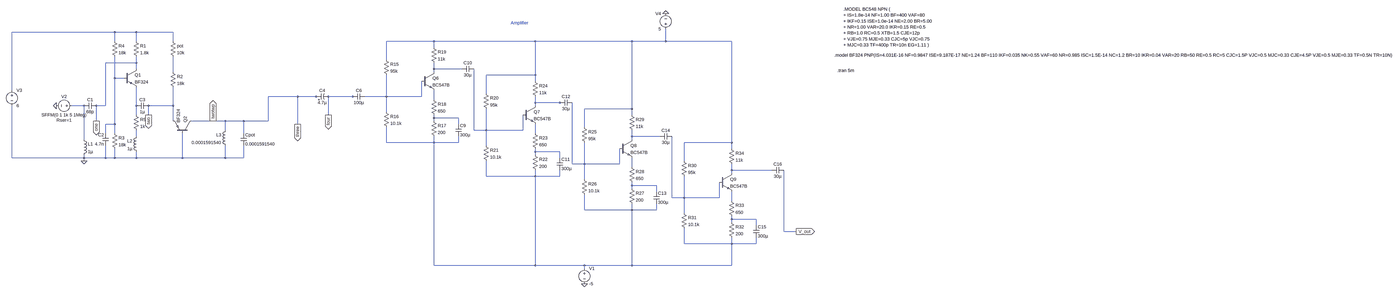
[diagram p0: schematic FM Radio using NPN Transistors.asc, whole sheet]
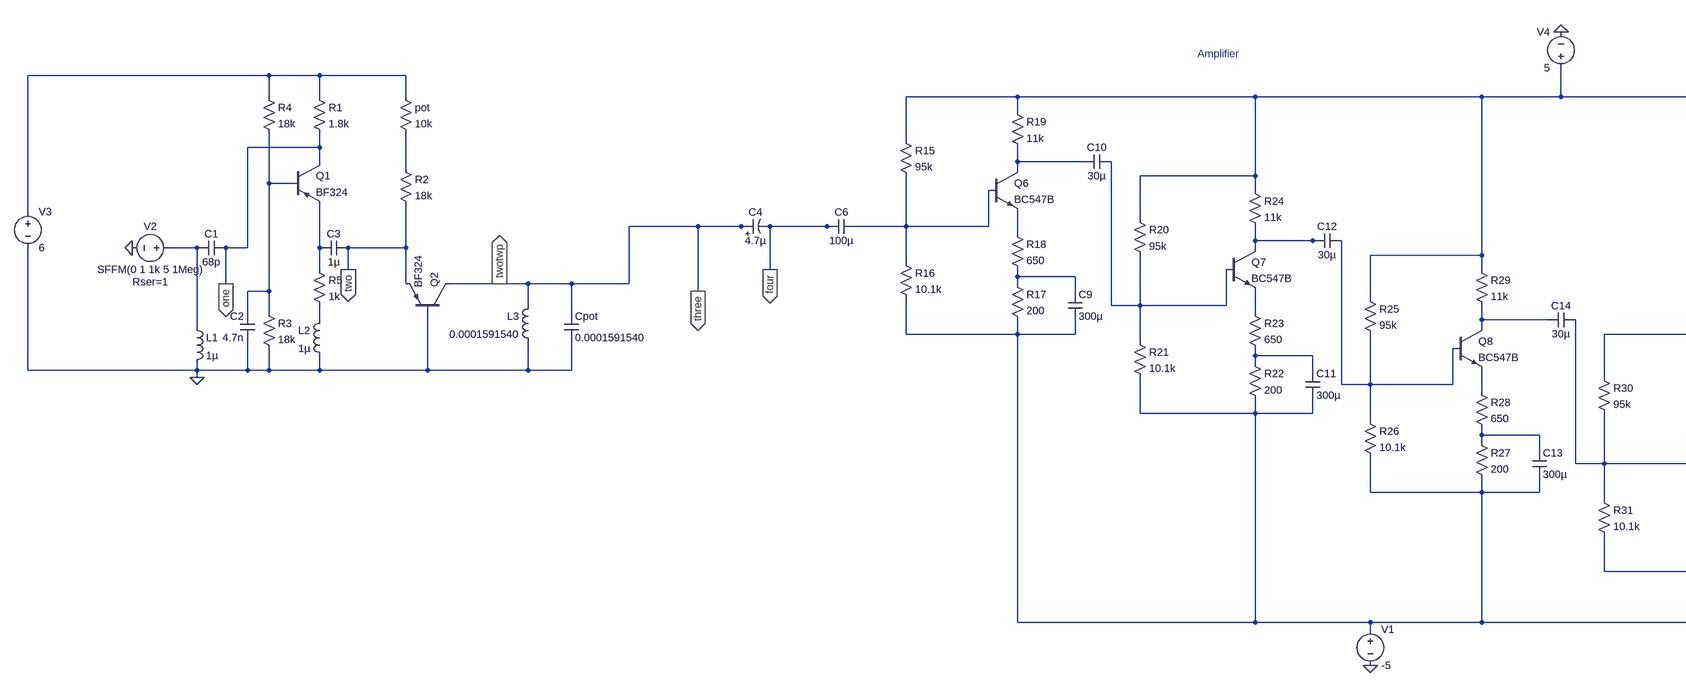
[diagram p1: schematic FM Radio using NPN Transistors.asc, part, row 1 of 1, column 1 of 2]
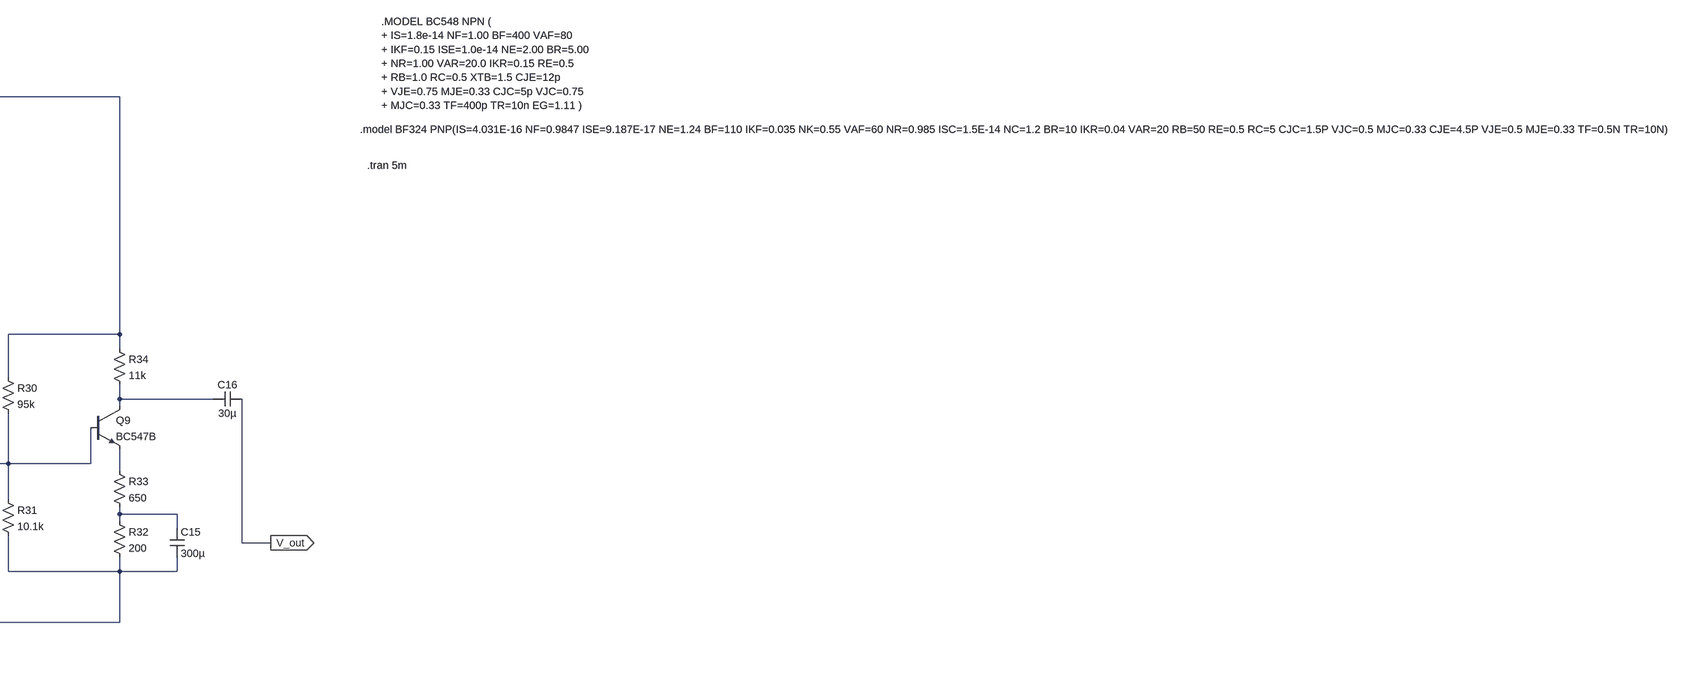
[diagram p2: schematic FM Radio using NPN Transistors.asc, part, row 1 of 1, column 2 of 2]
FM Radio using NPN Transistors.asc, the LTspice schematic file:
Version 4.1
SHEET 1 8000 1300
WIRE 384 -256 -192 -256
WIRE 496 -256 384 -256
WIRE 688 -256 496 -256
WIRE 384 -208 384 -256
WIRE 496 -208 496 -256
WIRE 688 -208 688 -256
WIRE 2064 -208 1808 -208
WIRE 2592 -208 2064 -208
WIRE 3104 -208 2592 -208
WIRE 3280 -208 3280 -272
WIRE 3280 -208 3104 -208
WIRE 3632 -208 3280 -208
WIRE 2064 -176 2064 -208
WIRE 1808 -112 1808 -208
WIRE 496 -96 496 -128
WIRE 496 -96 336 -96
WIRE 496 -64 496 -96
WIRE 2064 -64 2064 -96
WIRE 2208 -64 2064 -64
WIRE 688 -48 688 -128
WIRE 2064 -48 2064 -64
WIRE 2592 -32 2592 -208
WIRE 2592 -32 2336 -32
WIRE 384 -16 384 -128
WIRE 432 -16 384 -16
WIRE 2592 0 2592 -32
WIRE -192 48 -192 -256
WIRE 2336 64 2336 -32
WIRE 1344 80 1184 80
WIRE 1440 80 1344 80
WIRE 1456 80 1440 80
WIRE 1632 80 1504 80
WIRE 1648 80 1632 80
WIRE 1808 80 1808 -32
WIRE 1808 80 1696 80
WIRE 2000 80 2000 0
WIRE 2000 80 1808 80
WIRE 2064 96 2064 48
WIRE 2592 112 2592 80
WIRE 2720 112 2592 112
WIRE 2736 112 2720 112
WIRE 224 128 160 128
WIRE 336 128 336 -96
WIRE 336 128 288 128
WIRE 496 128 496 32
WIRE 688 128 688 32
WIRE 688 128 560 128
WIRE 2592 128 2592 112
WIRE 3104 144 3104 -208
WIRE 3104 144 2848 144
WIRE 1808 160 1808 80
WIRE 496 176 496 128
WIRE 560 176 560 128
WIRE 1504 176 1504 80
WIRE 3104 176 3104 144
WIRE 2064 192 2064 176
WIRE 2192 192 2064 192
WIRE 288 208 288 128
WIRE 688 208 688 128
WIRE 896 208 784 208
WIRE 960 208 896 208
WIRE 1056 208 960 208
WIRE 1184 208 1184 80
WIRE 1184 208 1056 208
WIRE 2064 208 2064 192
WIRE 384 224 384 -16
WIRE 384 224 336 224
WIRE 1344 224 1344 80
WIRE 2192 224 2192 192
WIRE 2848 240 2848 144
WIRE 960 256 960 208
WIRE 2272 256 2272 -64
WIRE 2336 256 2336 144
WIRE 2336 256 2272 256
WIRE 2528 256 2528 176
WIRE 2528 256 2336 256
WIRE 336 272 336 224
WIRE 384 272 384 224
WIRE 1056 272 1056 208
WIRE 2592 272 2592 224
WIRE 496 288 496 256
WIRE 3104 288 3104 256
WIRE 3248 288 3104 288
WIRE 224 304 224 128
WIRE 3104 304 3104 288
WIRE 1808 320 1808 240
WIRE 2064 320 2064 288
WIRE 2064 320 1808 320
WIRE 2192 320 2192 288
WIRE 2192 320 2064 320
WIRE 3632 320 3632 -208
WIRE 3632 320 3376 320
WIRE 2336 336 2336 256
WIRE 3632 352 3632 320
WIRE 2592 368 2592 352
WIRE 2720 368 2592 368
WIRE 2592 384 2592 368
WIRE -192 400 -192 128
WIRE 224 400 224 384
WIRE 224 400 -192 400
WIRE 336 400 336 336
WIRE 336 400 224 400
WIRE 384 400 384 352
WIRE 384 400 336 400
WIRE 496 400 496 368
WIRE 496 400 384 400
WIRE 736 400 736 272
WIRE 736 400 496 400
WIRE 960 400 960 336
WIRE 960 400 736 400
WIRE 1056 400 1056 336
WIRE 1056 400 960 400
WIRE 2720 400 2720 368
WIRE 224 416 224 400
WIRE 3376 416 3376 320
WIRE 2784 432 2784 112
WIRE 2848 432 2848 320
WIRE 2848 432 2784 432
WIRE 3040 432 3040 352
WIRE 3040 432 2848 432
WIRE 3104 448 3104 400
WIRE 3632 464 3632 432
WIRE 3840 464 3632 464
WIRE 3632 480 3632 464
WIRE 2336 496 2336 416
WIRE 2592 496 2592 464
WIRE 2592 496 2336 496
WIRE 2720 496 2720 464
WIRE 2720 496 2592 496
WIRE 2848 512 2848 432
WIRE 3104 544 3104 528
WIRE 3232 544 3104 544
WIRE 3104 560 3104 544
WIRE 3232 576 3232 544
WIRE 3312 608 3312 288
WIRE 3376 608 3376 496
WIRE 3376 608 3312 608
WIRE 3568 608 3568 528
WIRE 3568 608 3376 608
WIRE 3632 624 3632 576
WIRE 2848 672 2848 592
WIRE 3104 672 3104 640
WIRE 3104 672 2848 672
WIRE 3232 672 3232 640
WIRE 3232 672 3104 672
WIRE 3376 688 3376 608
WIRE 3632 720 3632 704
WIRE 3760 720 3632 720
WIRE 3632 736 3632 720
WIRE 3760 752 3760 720
WIRE 3904 784 3904 464
WIRE 3968 784 3904 784
WIRE 3376 848 3376 768
WIRE 3632 848 3632 816
WIRE 3632 848 3376 848
WIRE 3760 848 3760 816
WIRE 3760 848 3632 848
WIRE 2064 1056 2064 320
WIRE 2592 1056 2592 496
WIRE 2592 1056 2064 1056
WIRE 2848 1056 2592 1056
WIRE 3104 1056 3104 672
WIRE 3104 1056 2848 1056
WIRE 3632 1056 3632 848
WIRE 3632 1056 3104 1056
WIRE 2848 1072 2848 1056
FLAG 224 416 0
FLAG 80 128 0
FLAG 288 208 one
IOPIN 288 208 Out
FLAG 560 176 two
IOPIN 560 176 Out
FLAG 896 208 twotwp
IOPIN 896 208 Out
FLAG 1504 176 four
IOPIN 1504 176 Out
FLAG 3280 -352 0
FLAG 2848 1152 0
FLAG 3968 784 V_out
IOPIN 3968 784 Out
FLAG 1344 224 three
IOPIN 1344 224 Out
SYMBOL voltage 176 128 R90
WINDOW 0 -32 56 VBottom 2
WINDOW 3 32 56 VTop 2
WINDOW 123 0 0 Left 0
WINDOW 39 60 56 VTop 2
SYMATTR InstName V2
SYMATTR Value SFFM(0 1 1k 5 1Meg)
SYMATTR SpiceLine Rser=1
SYMBOL ind 208 288 R0
SYMATTR InstName L1
SYMATTR Value 1µ
SYMBOL cap 288 112 R90
WINDOW 0 0 32 VBottom 2
WINDOW 3 32 32 VTop 2
SYMATTR InstName C1
SYMATTR Value 68p
SYMBOL voltage -192 32 R0
SYMATTR InstName V3
SYMATTR Value 6
SYMBOL res 480 -224 R0
SYMATTR InstName R1
SYMATTR Value 1.8k
SYMBOL res 368 -224 R0
SYMATTR InstName R4
SYMATTR Value 18k
SYMBOL res 368 256 R0
SYMATTR InstName R3
SYMATTR Value 18k
SYMBOL cap 352 272 M0
SYMATTR InstName C2
SYMATTR Value 4.7n
SYMBOL ind 512 272 M0
SYMATTR InstName L2
SYMATTR Value 1µ
SYMBOL res 480 160 R0
SYMATTR InstName R5
SYMATTR Value 1k
SYMBOL pnp2 432 -64 R0
SYMATTR InstName Q1
SYMATTR Value BF324
SYMBOL cap 560 112 R90
WINDOW 0 0 32 VBottom 2
WINDOW 3 32 32 VTop 2
SYMATTR InstName C3
SYMATTR Value 1µ
SYMBOL res 672 -64 R0
SYMATTR InstName R2
SYMATTR Value 18k
SYMBOL res 672 -224 R0
SYMATTR InstName pot
SYMATTR Value 10k
SYMBOL pnp2 784 272 M270
SYMATTR InstName Q2
SYMATTR Value BF324
SYMBOL ind 976 240 M0
SYMATTR InstName L3
SYMATTR Value 0.0001591540
SYMBOL cap 1040 272 R0
SYMATTR InstName Cpot
SYMATTR Value 0.0001591540
SYMBOL polcap 1440 96 R270
WINDOW 0 32 32 VTop 2
WINDOW 3 0 32 VBottom 2
SYMATTR InstName C4
SYMATTR Value 4.7µ
SYMBOL cap 1696 64 R90
WINDOW 0 0 32 VBottom 2
WINDOW 3 32 32 VTop 2
SYMATTR InstName C6
SYMATTR Value 100µ
SYMBOL res 1792 -128 R0
SYMATTR InstName R15
SYMATTR Value 95k
SYMBOL res 1792 144 R0
SYMATTR InstName R16
SYMATTR Value 10.1k
SYMBOL res 2048 192 R0
SYMATTR InstName R17
SYMATTR Value 200
SYMBOL res 2048 80 R0
SYMATTR InstName R18
SYMATTR Value 650
SYMBOL npn 2000 -48 R0
SYMATTR InstName Q6
SYMATTR Value BC547B
SYMBOL res 2048 -192 R0
SYMATTR InstName R19
SYMATTR Value 11k
SYMBOL cap 2176 224 R0
SYMATTR InstName C9
SYMATTR Value 300µ
SYMBOL cap 2272 -80 R90
WINDOW 0 0 32 VBottom 2
WINDOW 3 32 32 VTop 2
SYMATTR InstName C10
SYMATTR Value 30µ
SYMBOL res 2320 48 R0
SYMATTR InstName R20
SYMATTR Value 95k
SYMBOL res 2320 320 R0
SYMATTR InstName R21
SYMATTR Value 10.1k
SYMBOL res 2576 368 R0
SYMATTR InstName R22
SYMATTR Value 200
SYMBOL res 2576 256 R0
SYMATTR InstName R23
SYMATTR Value 650
SYMBOL npn 2528 128 R0
SYMATTR InstName Q7
SYMATTR Value BC547B
SYMBOL res 2576 -16 R0
SYMATTR InstName R24
SYMATTR Value 11k
SYMBOL cap 2704 400 R0
SYMATTR InstName C11
SYMATTR Value 300µ
SYMBOL cap 2784 96 R90
WINDOW 0 0 32 VBottom 2
WINDOW 3 32 32 VTop 2
SYMATTR InstName C12
SYMATTR Value 30µ
SYMBOL res 2832 224 R0
SYMATTR InstName R25
SYMATTR Value 95k
SYMBOL res 2832 496 R0
SYMATTR InstName R26
SYMATTR Value 10.1k
SYMBOL res 3088 544 R0
SYMATTR InstName R27
SYMATTR Value 200
SYMBOL res 3088 432 R0
SYMATTR InstName R28
SYMATTR Value 650
SYMBOL npn 3040 304 R0
SYMATTR InstName Q8
SYMATTR Value BC547B
SYMBOL res 3088 160 R0
SYMATTR InstName R29
SYMATTR Value 11k
SYMBOL cap 3216 576 R0
SYMATTR InstName C13
SYMATTR Value 300µ
SYMBOL cap 3312 272 R90
WINDOW 0 0 32 VBottom 2
WINDOW 3 32 32 VTop 2
SYMATTR InstName C14
SYMATTR Value 30µ
SYMBOL res 3360 400 R0
SYMATTR InstName R30
SYMATTR Value 95k
SYMBOL res 3360 672 R0
SYMATTR InstName R31
SYMATTR Value 10.1k
SYMBOL res 3616 720 R0
SYMATTR InstName R32
SYMATTR Value 200
SYMBOL res 3616 608 R0
SYMATTR InstName R33
SYMATTR Value 650
SYMBOL npn 3568 480 R0
SYMATTR InstName Q9
SYMATTR Value BC547B
SYMBOL res 3616 336 R0
SYMATTR InstName R34
SYMATTR Value 11k
SYMBOL cap 3744 752 R0
SYMATTR InstName C15
SYMATTR Value 300µ
SYMBOL cap 3904 448 R90
WINDOW 0 0 32 VBottom 2
WINDOW 3 32 32 VTop 2
SYMATTR InstName C16
SYMATTR Value 30µ
SYMBOL voltage 3280 -256 R180
WINDOW 0 24 96 Left 2
WINDOW 3 24 16 Left 2
SYMATTR InstName V4
SYMATTR Value 5
SYMBOL voltage 2848 1056 R0
WINDOW 123 0 0 Left 0
WINDOW 39 0 0 Left 0
SYMATTR InstName V1
SYMATTR Value -5
TEXT 4912 -56 Left 2 !.tran 5m
TEXT 4896 -136 Left 2 !.model BF324 PNP(IS=4.031E-16 NF=0.9847 ISE=9.187E-17 NE=1.24 BF=110 IKF=0.035 NK=0.55 VAF=60 NR=0.985 ISC=1.5E-14 NC=1.2 BR=10 IKR=0.04 VAR=20 RB=50 RE=0.5 RC=5 CJC=1.5P VJC=0.5 MJC=0.33 CJE=4.5P VJE=0.5 MJE=0.33 TF=0.5N TR=10N)
TEXT 4944 -376 Left 2 !.MODEL BC548 NPN (\n+ IS=1.8e-14 NF=1.00 BF=400 VAF=80\n+ IKF=0.15 ISE=1.0e-14 NE=2.00 BR=5.00\n+ NR=1.00 VAR=20.0 IKR=0.15 RE=0.5\n+ RB=1.0 RC=0.5 XTB=1.5 CJE=12p\n+ VJE=0.75 MJE=0.33 CJC=5p VJC=0.75\n+ MJC=0.33 TF=400p TR=10n EG=1.11 )
TEXT 2464 -304 Left 2 ;Amplifier

The netlist it stands for:
* FM Radio using NPN Transistors.asc
V2 N009 0 SFFM(0 1 1k 5 1Meg) Rser=1
L1 N009 0 1µ
C1 one N009 68p
V3 N001 0 6
R1 N001 one 1.8k
R4 N001 N005 18k
R3 N005 0 18k
C2 N005 0 4.7n
L2 N014 0 1µ
R5 N010 N014 1k
Q1 one N005 N010 0 BF324
C3 two N010 1µ
R2 N004 two 18k
R§pot N001 N004 10k
Q2 three 0 two 0 BF324
L3 three 0 0.0001591540
Cpot three 0 0.0001591540
C4 three four 4.7µ
C6 N006 four 100µ
R15 N002 N006 95k
R16 N006 N016 10.1k
R17 N011 N016 200
R18 N007 N011 650
Q6 N003 N006 N007 0 BC547B
R19 N002 N003 11k
C9 N011 N016 300µ
C10 N012 N003 30µ
R20 N002 N012 95k
R21 N012 N016 10.1k
R22 N017 N016 200
R23 N013 N017 650
Q7 N008 N012 N013 0 BC547B
R24 N002 N008 11k
C11 N017 N016 300µ
C12 N018 N008 30µ
R25 N002 N018 95k
R26 N018 N016 10.1k
R27 N021 N016 200
R28 N019 N021 650
Q8 N015 N018 N019 0 BC547B
R29 N002 N015 11k
C13 N021 N016 300µ
C14 N022 N015 30µ
R30 N002 N022 95k
R31 N022 N016 10.1k
R32 N024 N016 200
R33 N023 N024 650
Q9 N020 N022 N023 0 BC547B
R34 N002 N020 11k
C15 N024 N016 300µ
C16 V_out N020 30µ
V4 N002 0 5
V1 N016 0 -5
.model NPN NPN
.model PNP PNP
.lib standard.bjt
.tran 5m
.model BF324 PNP(IS=4.031E-16 NF=0.9847 ISE=9.187E-17 NE=1.24 BF=110 IKF=0.035 NK=0.55 VAF=60 NR=0.985 ISC=1.5E-14 NC=1.2 BR=10 IKR=0.04 VAR=20 RB=50 RE=0.5 RC=5 CJC=1.5P VJC=0.5 MJC=0.33 CJE=4.5P VJE=0.5 MJE=0.33 TF=0.5N TR=10N)
.MODEL BC548 NPN (
+ IS=1.8e-14 NF=1.00 BF=400 VAF=80
+ IKF=0.15 ISE=1.0e-14 NE=2.00 BR=5.00
+ NR=1.00 VAR=20.0 IKR=0.15 RE=0.5
+ RB=1.0 RC=0.5 XTB=1.5 CJE=12p
+ VJE=0.75 MJE=0.33 CJC=5p VJC=0.75
+ MJC=0.33 TF=400p TR=10n EG=1.11 )
* Amplifier
.backanno
.end